# EAGLE design port_adaptor_1_2 (EAGLE 6.6.0)
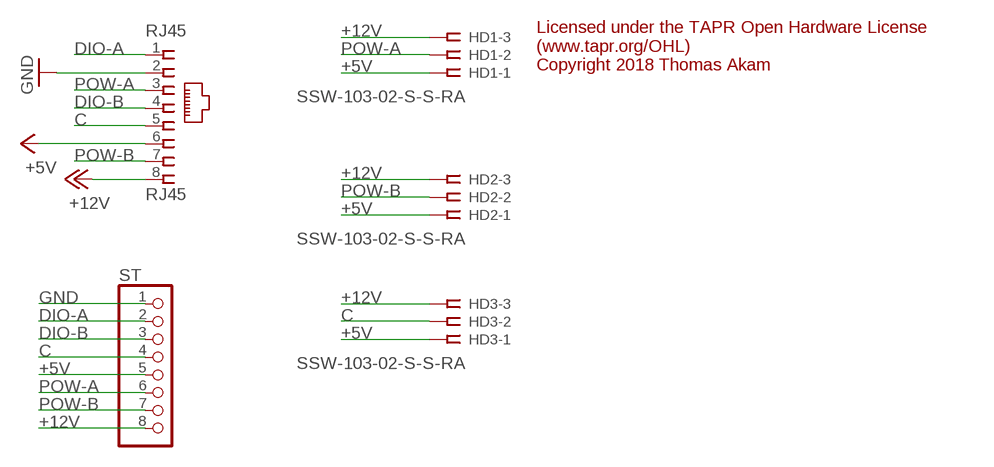
[diagram p0: schematic, sheet 1]

## Parts
HD1  SSW-103-02-S-S-RA  [SSW-103-02-S-S-RA]
HD2  SSW-103-02-S-S-RA  [SSW-103-02-S-S-RA]
HD3  SSW-103-02-S-S-RA  [SSW-103-02-S-S-RA]
RJ45  RJ45  RJ45VERTICAL  [RJ45-NO-SHIELD-VERTICAL]
ST  PINHD-1X8  [1X08]

## Nets
+5V: HD1.1 HD2.1 HD3.1 RJ45.6 ST.5
+12V: HD1.3 HD2.3 HD3.3 RJ45.8 ST.8
C: HD3.2 RJ45.5 ST.4
DIO-A: RJ45.1 ST.2
DIO-B: RJ45.4 ST.3
GND: RJ45.2 ST.1
POW-A: HD1.2 RJ45.3 ST.6
POW-B: HD2.2 RJ45.7 ST.7

## Notes on the sheet
- Licensed under the TAPR Open Hardware License
  (www.tapr.org/OHL)
  Copyright 2018 Thomas Akam

## Library data of the parts
HD1-HD3 = con-samtec:SSW-103-02-S-S: THROUGH-HOLE .025" SQ POST SOCKET Source: Samtec SSW.pdf; MPN: SSW-103-02-S-S-RA; OC_FARNELL: unknown; OC_NEWARK: 11P9368
RJ45 = con-tycoelectronics-vertical_RJ45:RJ45: CORCOM Modular RJ Jacks No Shield Source: www.tycoelectronics.com .. ENG_DS_1654001_1099_RJ_L_0507.pdf
ST = pinhead:PINHD-1X8: PIN HEADER

## Board
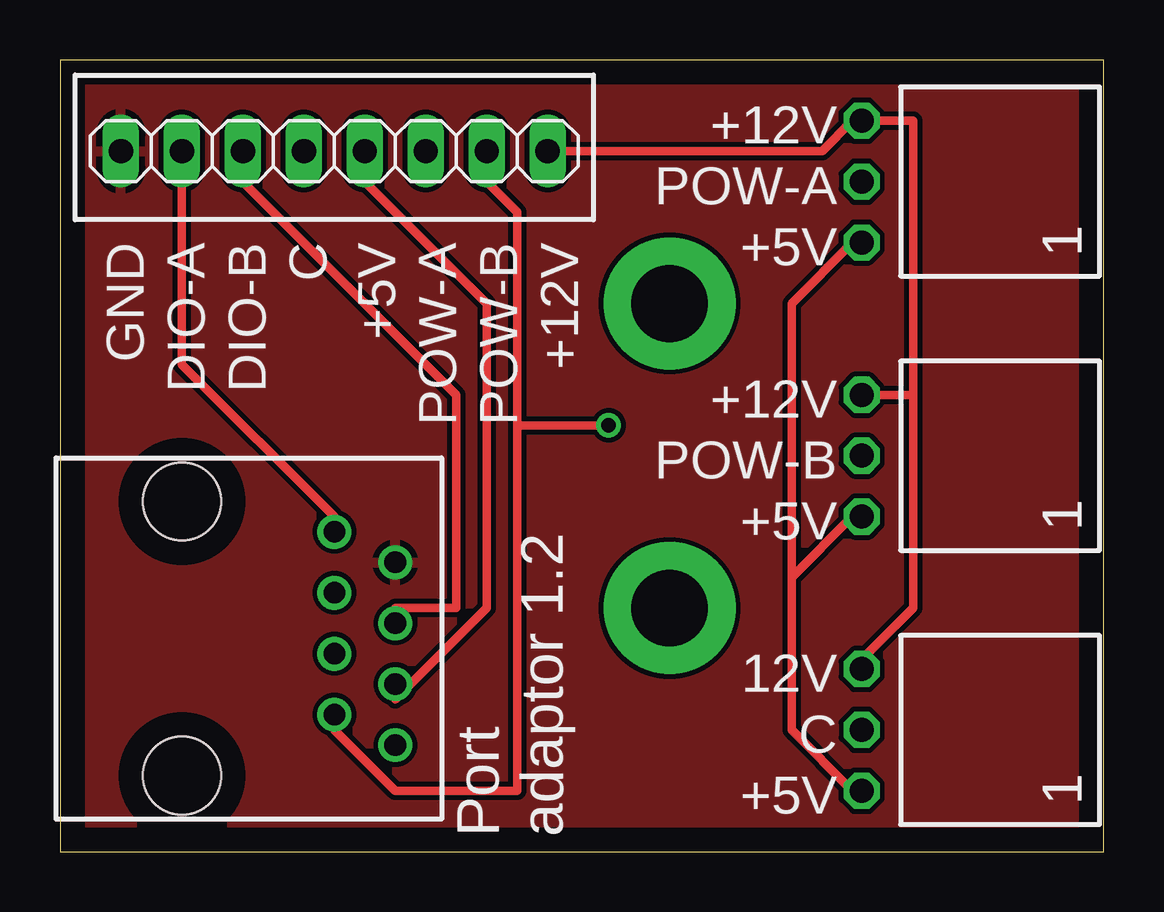
[diagram p1: board, top side]
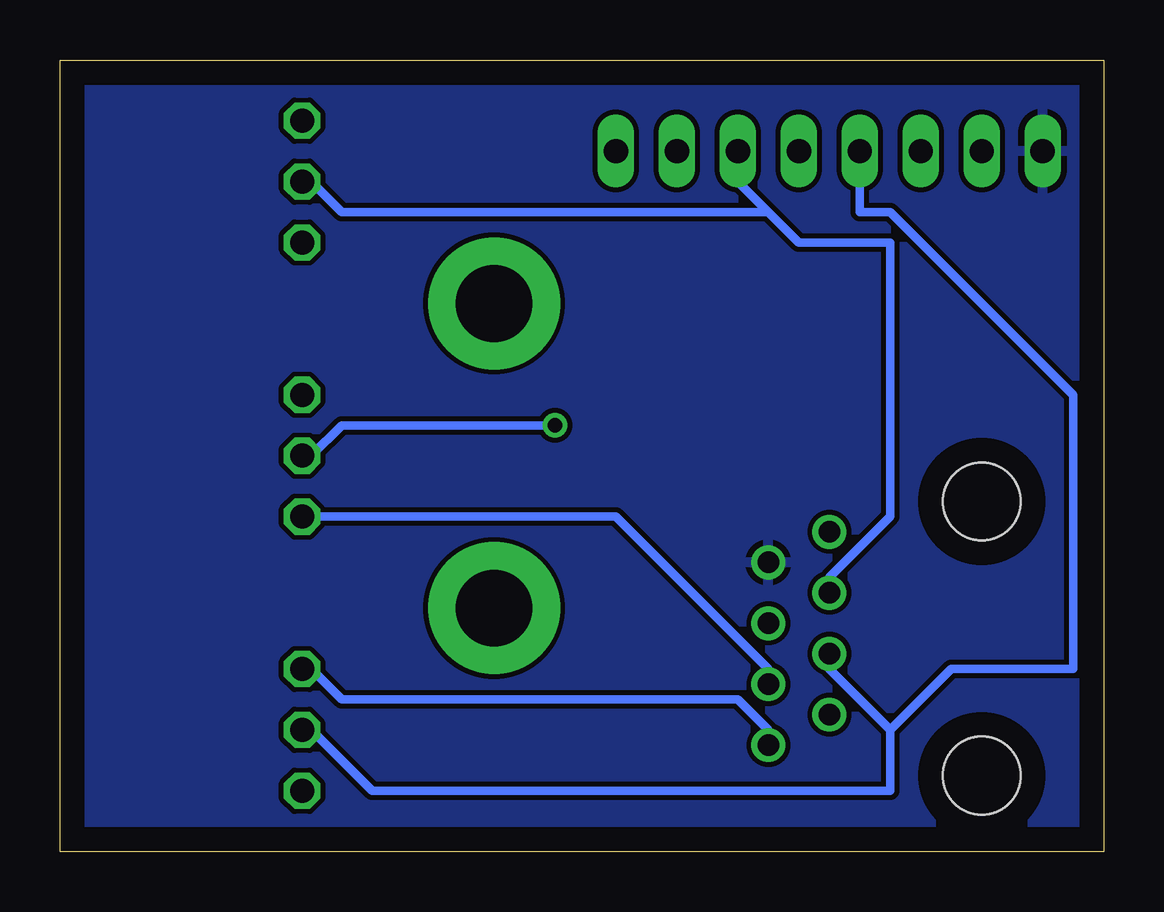
[diagram p2: board, bottom side, seen from below]

Size 43.48 x 33.01 mm. Coordinates in mm from the lower left corner, seen from the top.
Outline: 0,0 43.48,0 43.48,33.01 0,33.01 0,0
Copper layers (1*16): Top 0.035mm / dielectric 1.5mm / Bottom 0.035mm
Design rules "default": minimum track width 14mil, minimum drill 24mil, track to track 8mil, track to pad 8mil, pad to pad 8mil, via to via 8mil, smd to smd 8mil, copper to edge 40mil, drill to drill 8mil, minimum pad ring 10mil, minimum via ring 8mil, stop-mask expansion 4mil, vias tented up to drill 0mil, thermal gap 10mil
vRestrict: area 1.3,17.1 to 22.2,26.7; area 15.9,0 to 21.6,17.1; area 27.3,0.6 to 34.9,8.9; area 24.1,12.7 to 34.9,20.3; area 24.1,24.1 to 34.9,31.8

### Footprints (pad centres in the part's own frame; a part is rotated, then mirrored left to right if it is on the bottom)
SSW-103-02-S-S-RA = drill 1 pad 1.5 octagon: 1 -2.54,1.524; 2 0,1.524; 3 2.54,1.524
RJ45-NO-SHIELD-VERTICAL = drill 0.9 pad 1.4: 1 -4.445,5.08; 2 -3.175,7.62; 3 -1.905,5.08; 4 -0.635,7.62; 5 0.635,5.08; 6 1.905,7.62; 7 3.175,5.08; 8 4.445,7.62 | hole 3.251: -5.715,-1.27; 5.715,-1.27
1X08 = drill 1.016 long: 1 -8.89,0; 2 -6.35,0; 3 -3.81,0; 4 -1.27,0; 5 1.27,0; 6 3.81,0; 7 6.35,0; 8 8.89,0

### Placement (x,y rotation side)
HD1  34.92,27.94 90 top
HD2  34.92,16.51 90 top
HD3  34.92,5.08 90 top
RJ45  6.35,8.89 270 top
ST  11.43,29.21 0 top

### Tracks (layer width: path | path; a pad name or v marks a point on that pad's centre or on a via)
+5V
  Top 0.356: 30.48,11.43 30.48,5.08 33.02,2.54 HD3.1 | 30.48,11.43 33.02,13.97 HD2.1 | 30.48,11.43 30.48,22.86 33.02,25.4 HD1.1 | ST.5 12.7,27.94 17.78,22.86 17.78,10.16 13.97,6.35 RJ45.6
  Bottom 0.356: HD2.1 20.32,13.97 13.97,7.62 RJ45.6
+12V
  Top 0.356: 35.56,19.05 HD2.3 33.02,19.05 | 35.56,19.05 35.56,10.16 33.02,7.62 HD3.3 | 35.56,19.05 35.56,30.48 HD1.3 33.02,30.48 31.75,29.21 ST.8
  Bottom 0.356: RJ45.8 13.97,5.08 15.24,6.35 31.75,6.35 33.02,7.62 HD3.3
C
  Bottom 0.356: 8.89,5.08 11.43,7.62 RJ45.5 | 8.89,5.08 8.89,2.54 30.48,2.54 33.02,5.08 HD3.2 | ST.4 10.16,26.67 8.89,26.67 1.27,19.05 1.27,7.62 6.35,7.62 8.89,5.08
DIO-A
  Top 0.356: ST.2 5.08,20.32 11.43,13.97 RJ45.1
DIO-B
  Top 0.356: ST.3 7.62,27.94 16.51,19.05 16.51,10.16 13.97,10.16 RJ45.4
GND
  pour Bottom: 0,0 0,33.02 43.81,33.02 43.81,0
  pour Top: 0,0 0,33.02 43.81,33.02 43.81,0
N$1  (via drill 3.2 pad 5.5)
  other vias: 25.4,22.86
N$2  (via drill 3.2 pad 5.5)
  other vias: 25.4,10.16
POW-A
  Bottom 0.356: 13.97,26.67 15.24,27.94 ST.6 | 13.97,26.67 12.7,25.4 8.89,25.4 8.89,13.97 11.43,11.43 RJ45.3 | 13.97,26.67 31.75,26.67 33.02,27.94 HD1.2
POW-B  (via drill 0.61)
  Top 0.356: 19.05,17.78 19.05,26.67 17.78,27.94 ST.7 | 19.05,17.78 19.05,2.54 13.97,2.54 11.43,5.08 RJ45.7 | 19.05,17.78 v22.86,17.78
  Bottom 0.356: v22.86,17.78 31.75,17.78 33.02,16.51 HD2.2

### Text on the board
tPlace: +12V | POW-A | +5V | GND | DIO-A | DIO-B | C | +5V | POW-A | POW-B | +12V | +12V | POW-B | +5V | 12V | C | +5V | Port / adaptor 1.2
Document: Licensed under the TAPR Open Hardware License / (www.tapr.org/OHL) / Copyright 2018 Thomas Akam